# EAGLE design bikealarm (EAGLE 9.3.0)
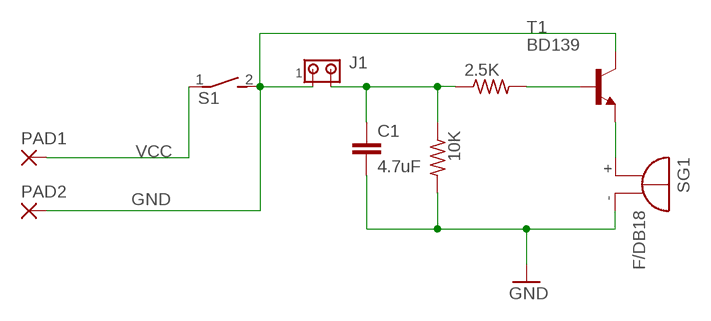
[diagram p0: schematic, sheet 1]

## Parts
2.5K  R-US_0204/7  [0204/7]
10K  R-US_0204/7  [0204/7]
C1  4.7uF  C-EU025-030X050  [C025-030X050]
J1  MTA02-156  [1X2MTA]
PAD1  2,15/1,0  [2,15/1,0]
PAD2  2,15/1,0  [2,15/1,0]
S1  DS01E  [DS-01]
SG1  F/DB18  [F/DB18]
T1  BD139  [TO126]

## Nets
GND: 10K.2 C1.2 J1.1 PAD2.1(P) S1.2 SG1.- T1.2(C)
N$1: SG1.+ T1.1(E)
N$2: 2.5K.2 T1.3(B)
N$3: 2.5K.1 10K.1 C1.1 J1.2
VCC: PAD1.1(P) S1.1

## Library data of the parts
2.5K 10K = rcl:R-US_: RESISTOR, American symbol; SPICEPREFIX: R
C1 = rcl:C-EU: CAPACITOR, European symbol; SPICEPREFIX: C
J1 = con-amp:MTA02-156: AMP connector
PAD1 PAD2 = wirepad:2,15/1,0: THROUGH-HOLE PAD
S1 = switch-dil:DS01E: DIL/CODE SWITCH; OC_FARNELL: unknown; OC_NEWARK: unknown
SG1 = buzzer:F/DB18: BUZZER Source: Buerklin; OC_FARNELL: unknown; OC_NEWARK: unknown
T1 = transistor:BD139: NPN TRANSISTOR

## Board
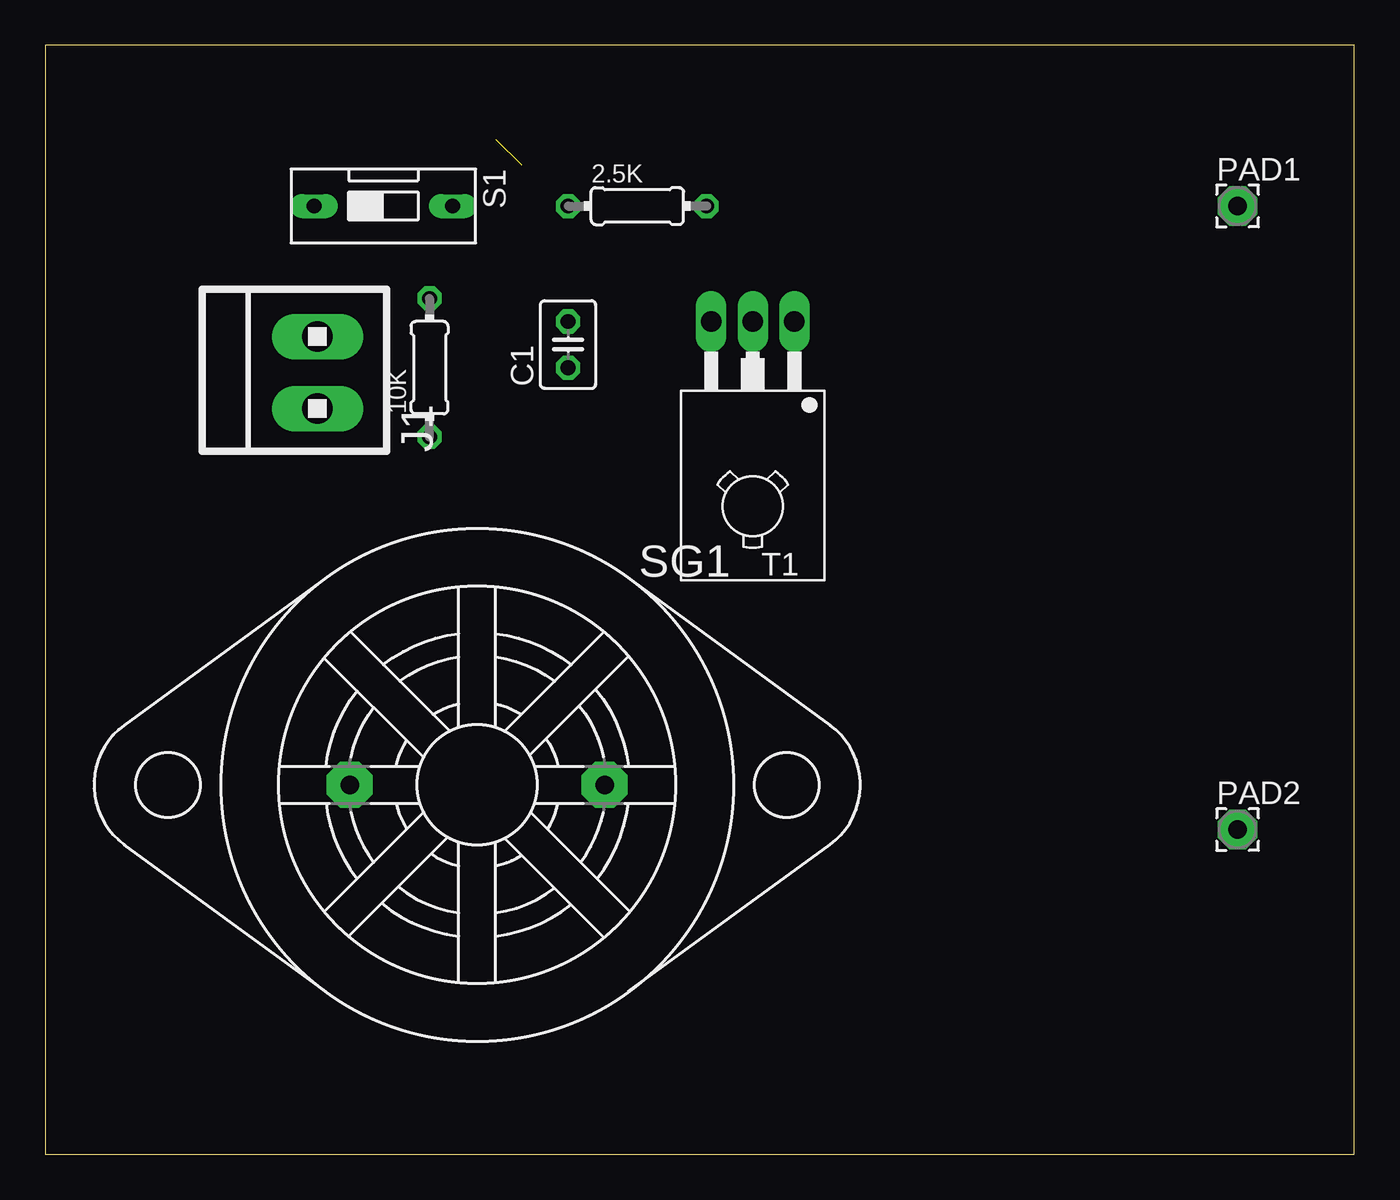
[diagram p1: board, top side]
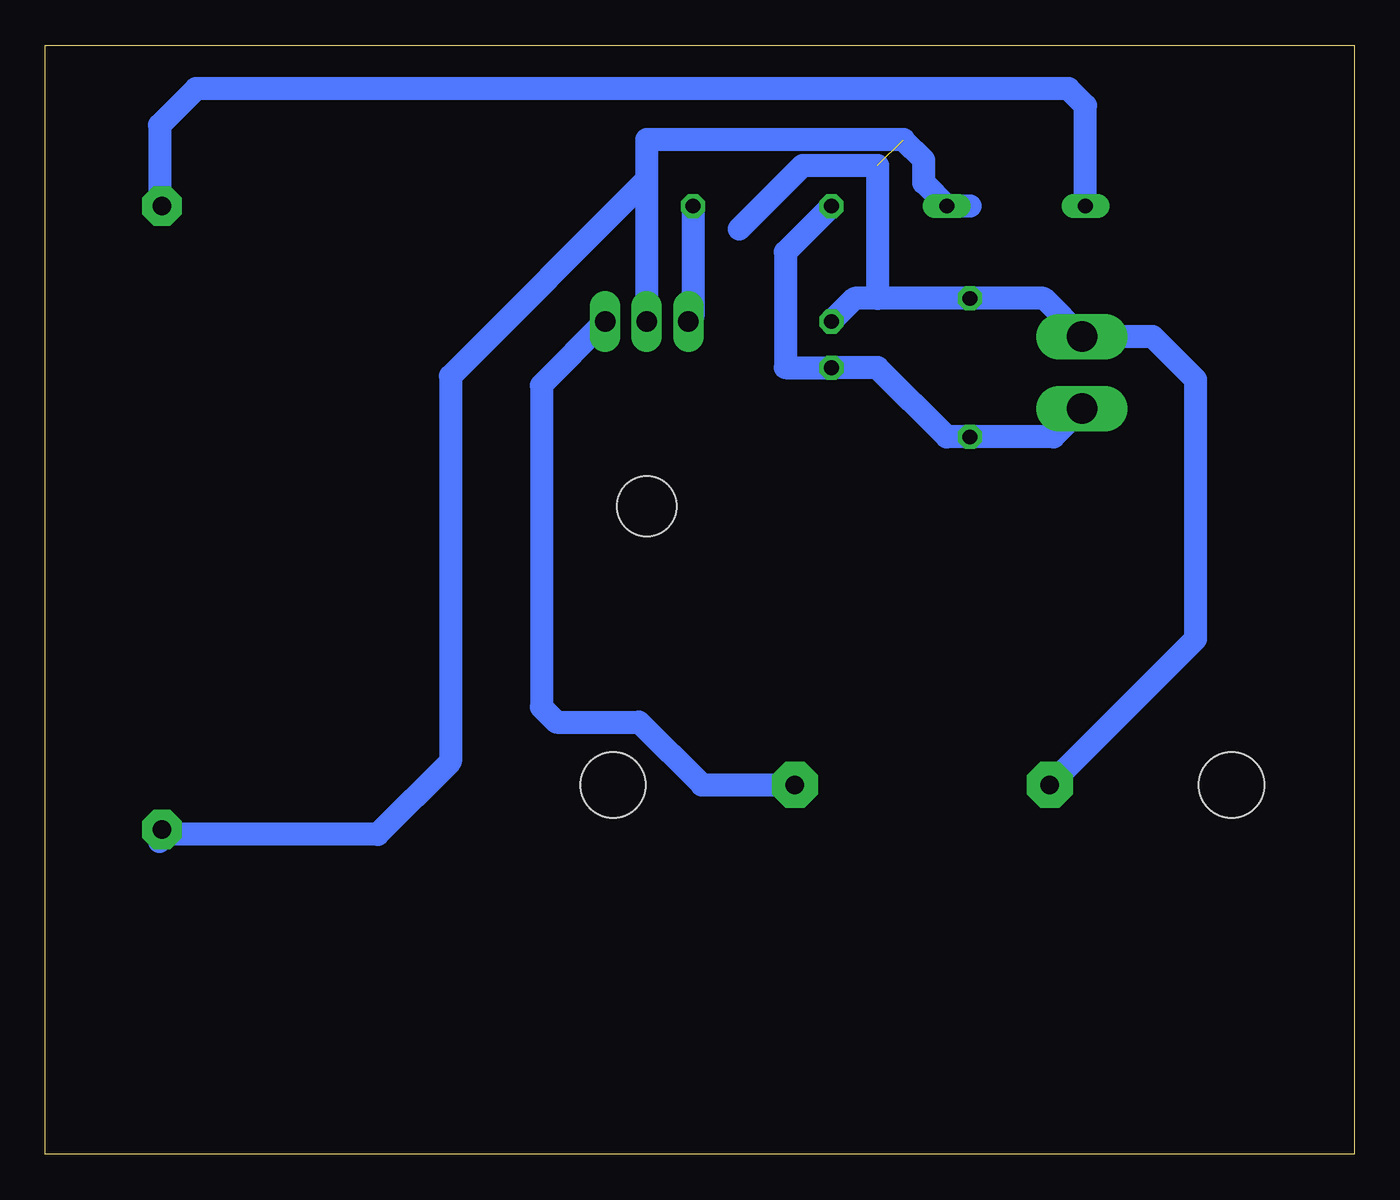
[diagram p2: board, bottom side, seen from below]

Size 71.99 x 60.98 mm. Coordinates in mm from the lower left corner, seen from the top.
Outline: 0,0 71.99,0 71.99,60.98 0,60.98 0,0
Copper layers (1*16): Top 0.035mm / dielectric 1.5mm / Bottom 0.035mm
Design rules "default": minimum track width 6mil, minimum drill 0.35mm, track to track 6mil, track to pad 6mil, pad to pad 6mil, via to via 6mil, smd to smd 6mil, copper to edge 40mil, drill to drill 6mil, minimum pad ring 10mil, minimum via ring 8mil, stop-mask expansion 4mil, vias tented up to drill 0mil, thermal gap 10mil

### Footprints (pad centres in the part's own frame; a part is rotated, then mirrored left to right if it is on the bottom)
0204/7 = drill 0.813 octagon: 1 -3.81,0; 2 3.81,0
C025-030X050 = drill 0.813 octagon: 1 -1.27,0; 2 1.27,0
1X2MTA = drill 1.676 long: 1 1.981,0; 2 -1.981,0
2,15/1,0 = drill 1.016 pad 2.159 octagon: 1 0,0
DS-01 = drill 0.813 long: 1 0,-3.81; 2 0,3.81
F/DB18 = drill 1.016 pad 2.54 octagon: + 7.01,0; - -7.01,0 | hole 3.607: 17.018,0; -17.018,0
TO126 = drill 1.118 long: 1 -2.286,-5.08; 2 0,-5.08; 3 2.286,-5.08 | hole 3.302: 0,5.08

### Placement (x,y rotation side)
2.5K  32.56,52.15 0 top
10K  21.13,43.26 90 top
C1  28.75,44.53 90 top
J1  14.97,42.99 90 top
PAD1  65.58,52.15 0 top
PAD2  65.58,17.86 0 top
S1  18.59,52.15 270 top
SG1  23.75,20.32 0 top
T1  38.91,40.72 180 top

### Tracks (layer width: path | path; a pad name or v marks a point on that pad's centre or on a via)
GND  (1 unrouted)
  Bottom 1.27: 26.21,47.07 10K.2 17.07,47.07 J1.1 11.08,44.97 8.71,42.6 8.71,28.35 SG1.- | 26.21,47.07 27.48,47.07 C1.2 | 33.83,50.88 30.32,54.38 26.21,54.38 26.21,47.07 | 21.13,52.15 S1.2 23.67,53.42 23.67,54.69 24.79,55.81 38.91,55.81 38.91,53.6 | 38.91,53.6 T1.2 | 65.32,17.6 PAD2.1 | 65.71,17.21 65.32,17.6 | 38.91,53.6 49.71,42.8 49.71,21.6 53.71,17.6 65.32,17.6
N$1
  Bottom 1.27: T1.1 44.71,42.29 44.71,24.6 43.88,23.77 39.34,23.77 35.88,20.32 SG1.+
N$2
  Bottom 1.27: 2.5K.2 36.37,46.05 T1.3
N$3
  Bottom 1.27: 2.5K.1 31.29,49.61 31.29,43.26 C1.1 26.21,43.26 22.4,39.45 10K.1 16.53,39.45 J1.2
VCC
  Bottom 1.27: S1.1 14.78,57.67 15.71,58.6 63.71,58.6 65.71,56.6 65.71,52.28 PAD1.1